# EAGLE design power (EAGLE 7.1.0)
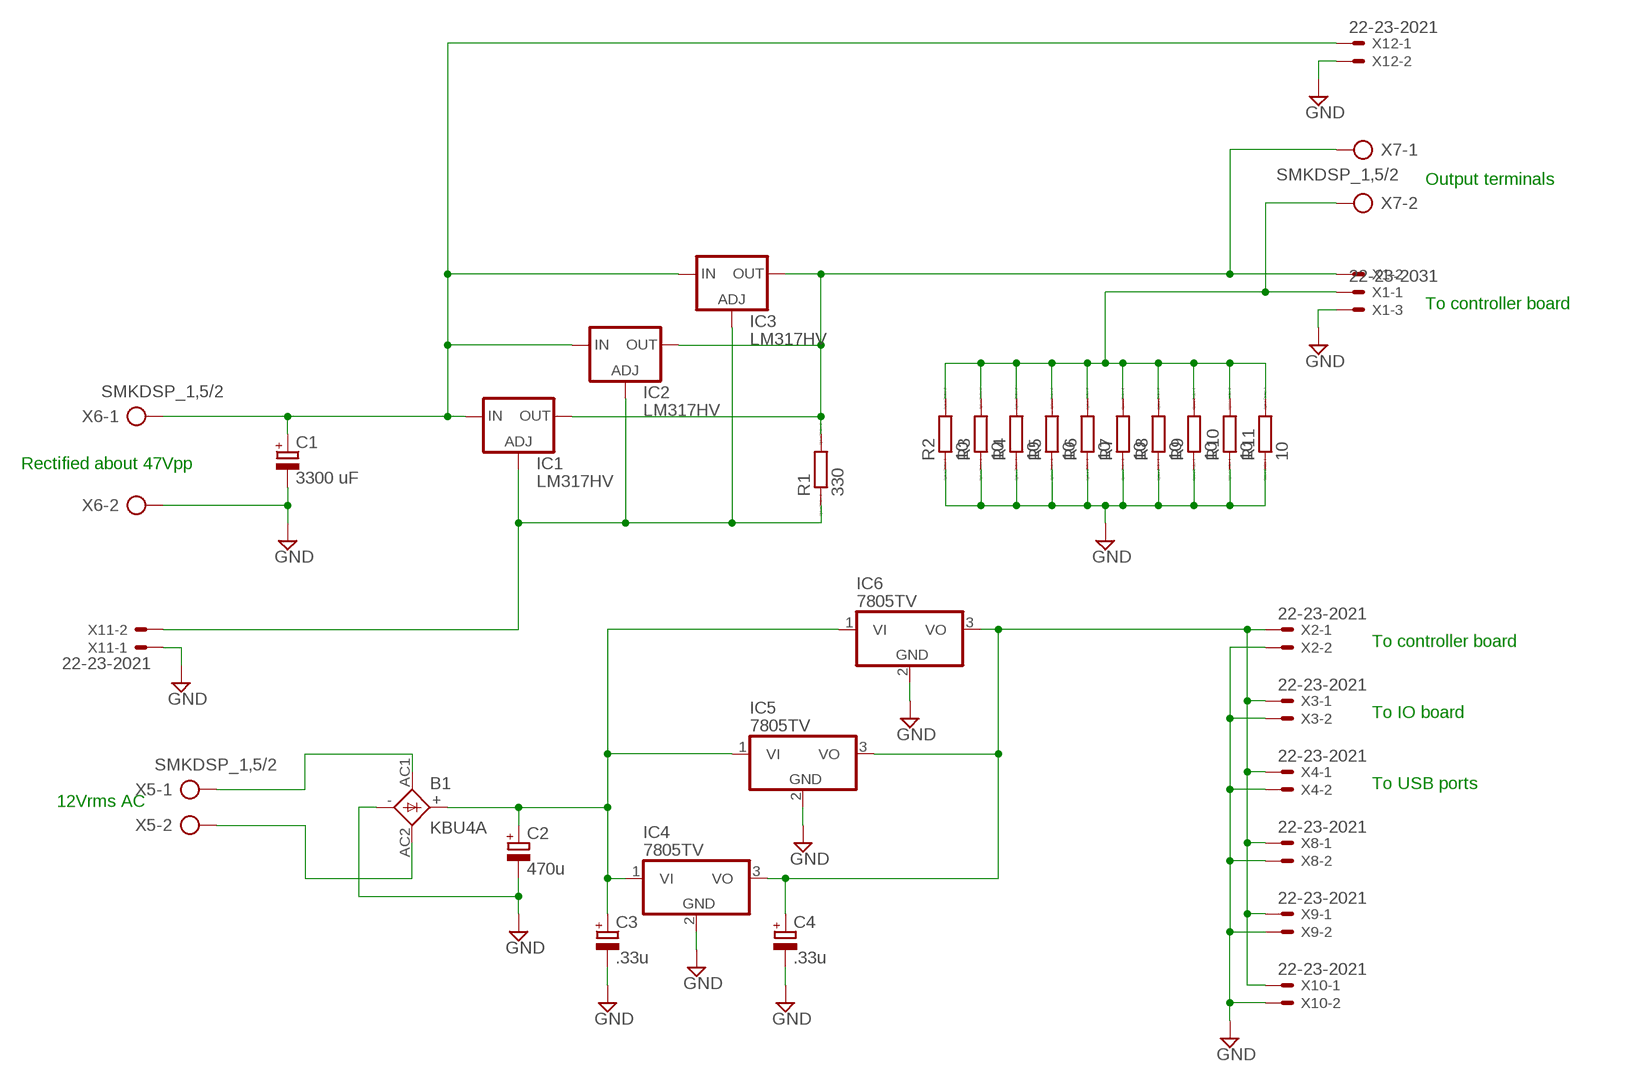
[diagram p0: schematic, sheet 1]

## Parts
B1  KBU4A  2KBB-R  [2KBB-R]
C1  3300 uF  CPOL-EUE10-25  [EB25D]
C2  470u  CPOL-EUE5-10.5  [E5-10,5]
C3  .33u  CPOL-EUE2-5  [E2-5]
C4  .33u  CPOL-EUE2-5  [E2-5]
IC1  LM317HV  LM317TS  [317TS]
IC2  LM317HV  LM317TS  [317TS]
IC3  LM317HV  LM317TS  [317TS]
IC4  7805TV  [TO220V]
IC5  7805TV  [TO220V]
IC6  7805TV  [TO220V]
R1  330  R-EU_0207_7  [0207/7]
R2  10  R-EU_0204_7  [0204/7]
R3  10  R-EU_0204_7  [0204/7]
R4  10  R-EU_0204_7  [0204/7]
R5  10  R-EU_0204_7  [0204/7]
R6  10  R-EU_0204_7  [0204/7]
R7  10  R-EU_0204_7  [0204/7]
R8  10  R-EU_0204_7  [0204/7]
R9  10  R-EU_0204_7  [0204/7]
R10  10  R-EU_0204_7  [0204/7]
R11  10  R-EU_0204_7  [0204/7]
X1  22-23-2031  [22-23-2031]
X2  22-23-2021  [22-23-2021]
X3  22-23-2021  [22-23-2021]
X4  22-23-2021  [22-23-2021]
X5  SMKDSP_1,5/2  [SMKDSP_1,5/2]
X6  SMKDSP_1,5/2  [SMKDSP_1,5/2]
X7  SMKDSP_1,5/2  [SMKDSP_1,5/2]
X8  22-23-2021  [22-23-2021]
X9  22-23-2021  [22-23-2021]
X10  22-23-2021  [22-23-2021]
X11  22-23-2021  [22-23-2021]
X12  22-23-2021  [22-23-2021]

## Nets
GND: B1.- C1.- C2.- C3.- C4.- IC4.2(GND) IC5.2(GND) IC6.2(GND) R2.1 R3.1 R4.1 R5.1 R6.1 R7.1 R8.1 R9.1 R10.1 R11.1 X1.3 X2.2 X3.2 X4.2 X6.2 X8.2 X9.2 X10.2 X11.1 X12.2
N$2: B1.AC1 X5.1
N$3: C1.+ IC1.3(IN) IC2.3(IN) IC3.3(IN) X6.1 X12.1
N$4: B1.AC2 X5.2
N$5: IC1.2(OUT) IC2.2(OUT) IC3.2(OUT) R1.2 X1.2 X7.1
N$7: B1.+ C2.+ C3.+ IC4.1(VI) IC5.1(VI) IC6.1(VI)
N$9: C4.+ IC4.3(VO) IC5.3(VO) IC6.3(VO) X2.1 X3.1 X4.1 X8.1 X9.1 X10.1
N$10: IC1.1(ADJ) IC2.1(ADJ) IC3.1(ADJ) R1.1 X11.2
N$11: R2.2 R3.2 R4.2 R5.2 R6.2 R7.2 R8.2 R9.2 R10.2 R11.2 X1.1 X7.2

## Notes on the sheet
- Output terminals
- To controller board
- Rectified about 47Vpp
- To controller board
- To IO board
- To USB ports
- 12Vrms AC

## Library data of the parts
B1 = rectifier:2KBB-R: RECTIFIER grid 3 x 5 mm
C1-C4 = rcl:CPOL-EU: POLARIZED CAPACITOR, European symbol
IC1-IC3 = v-reg:LM317TS: VOLTAGE REGULATOR
IC4-IC6 = linear:78*: Positive VOLTAGE REGULATOR Source: http://cache.national.com/ds/LM/LM78L05.pdf http://www.fairchildsemi.com/ds/LM/LM7805.pdf
R1-R11 = resistor:R-EU_: RESISTOR, European symbol; SPICEPREFIX: R
X1 = con-molex:22-23-2031: .100" (2.54mm) Center Header - 3 Pin; MF: MOLEX; MPN: 22-23-2031; OC_FARNELL: 1462950; OC_NEWARK: 30C0862
X2-X4 X8-X12 = con-molex:22-23-2021: .100" (2.54mm) Center Header - 2 Pin; MF: MOLEX; MPN: 22-23-2021; OC_FARNELL: 1462926; OC_NEWARK: 25C3832
X5-X7 = con-phoenix-smkdsp:SMKDSP_1,5/2: Printklemme, Nennstrom: 17,5 A, Bemessungsspannung: 250 V, Raster: 5,0 mm Source: http://eshop.phoenixcontact.de .. 1733415.pdf; MF: FARNELL; MPN: 1733570; OC_FARNELL: 3041244; OC_NEWARK: 69C8588

## Board
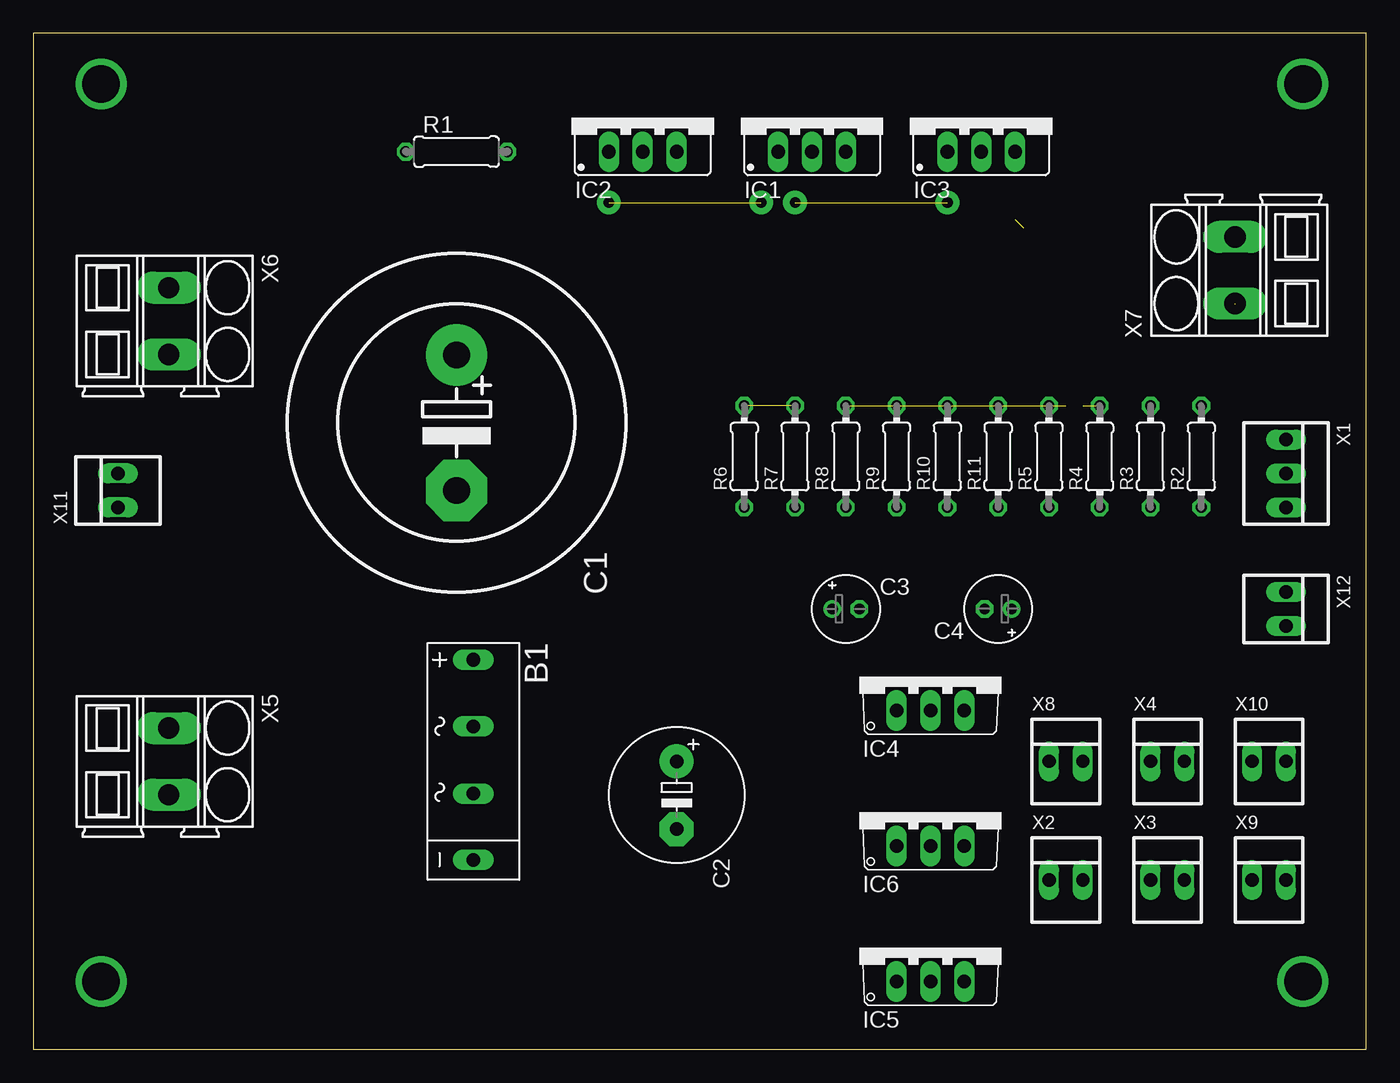
[diagram p1: board, top side]
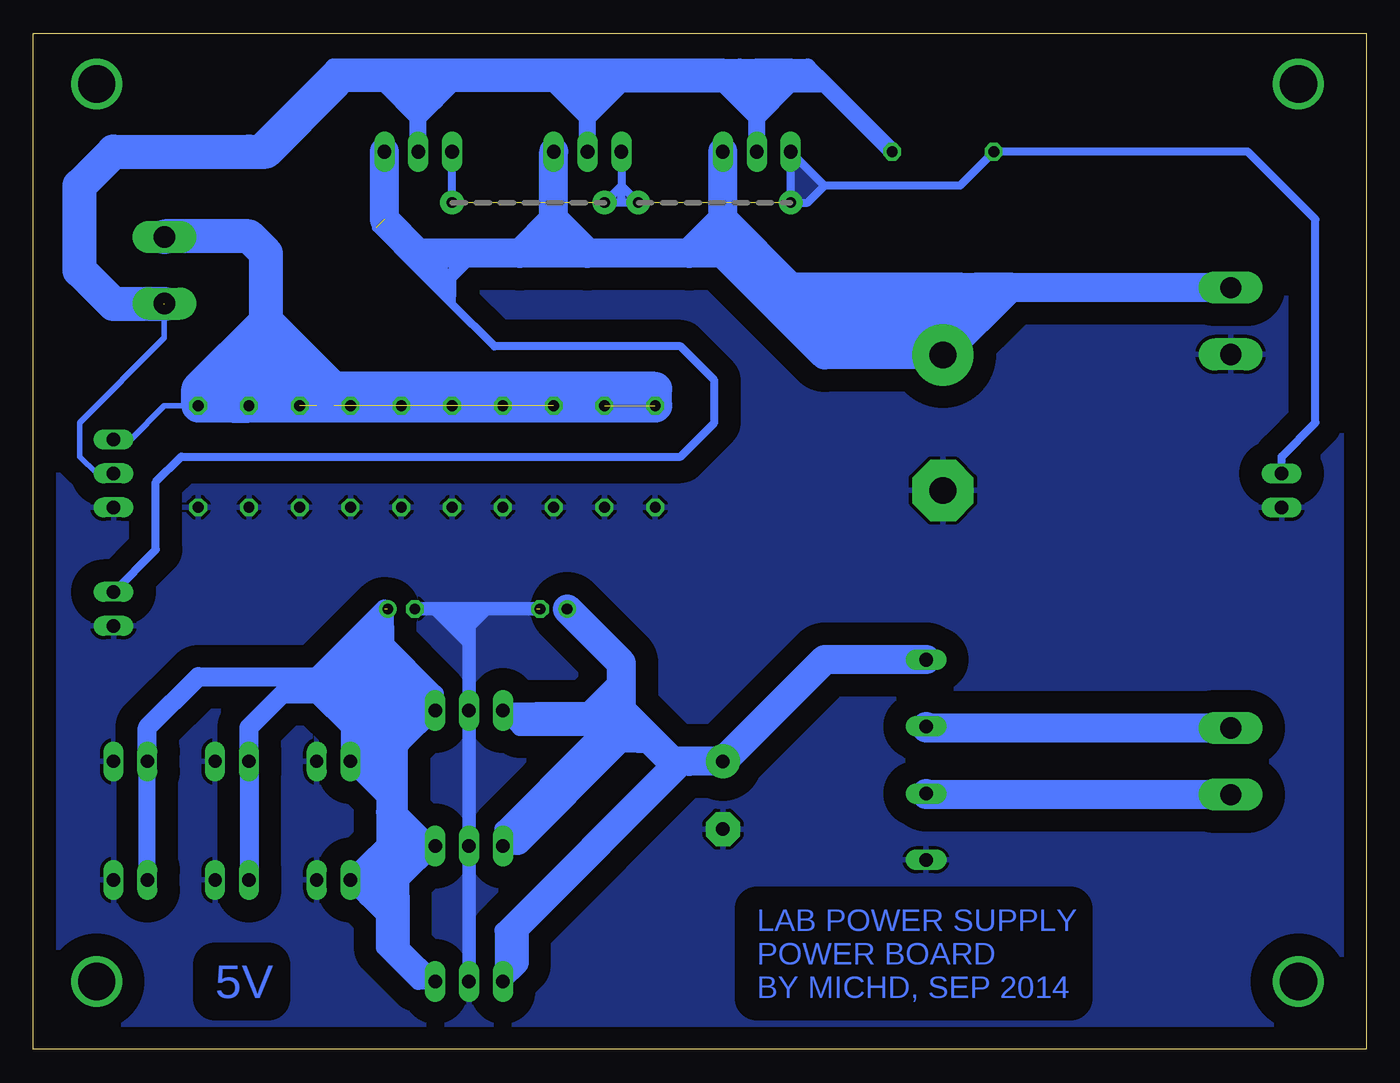
[diagram p2: board, bottom side, seen from below]

Size 100 x 76.19 mm. Coordinates in mm from the lower left corner, seen from the top.
Outline: 0,0 100,0 100,76.19 0,76.19 0,0
Copper layers (1*16): Top 0.035mm / dielectric 1.5mm / Bottom 0.035mm
Design rules "default": minimum track width 10mil, minimum drill 24mil, track to track 8mil, track to pad 8mil, pad to pad 8mil, via to via 8mil, smd to smd 8mil, copper to edge 40mil, drill to drill 8mil, minimum pad ring 10mil, minimum via ring 8mil, stop-mask expansion 4mil, vias tented up to drill 0mil, thermal gap 10mil

### Footprints (pad centres in the part's own frame; a part is rotated, then mirrored left to right if it is on the bottom)
2KBB-R = drill 1.016 long: + -7.62,0; - 7.391,0; AC1 -2.616,0; AC2 2.413,0
EB25D = drill 2.007 pad 4.597: + -5.08,0 | drill 2.007 pad 4.597 octagon: - 5.08,0
E5-10,5 = drill 1.016 pad 2.54: + -2.54,0 | drill 1.016 pad 2.54 octagon: - 2.54,0
E2-5 = drill 0.813 pad 1.27: + -1.016,0 | drill 0.813 pad 1.27 octagon: - 1.016,0
317TS = drill 1.016 long: 1 -2.54,-2.54; 2 0,-2.54; 3 2.54,-2.54
TO220V = drill 1.016 long: 1 -2.54,-2.54; 2 0,-2.54; 3 2.54,-2.54
0207/7 = drill 0.813 octagon: 1 -3.81,0; 2 3.81,0
0204/7 = drill 0.813 octagon: 1 -3.81,0; 2 3.81,0
22-23-2031 = drill 1 long: 1 -2.54,0; 2 0,0; 3 2.54,0
22-23-2021 = drill 1 long: 1 -1.27,0; 2 1.27,0
SMKDSP_1,5/2 = drill 1.6 pad 1.8 long: 1 -2.5,0; 2 2.5,0

### Placement (x,y rotation side)
B1  33.02,21.59 270 top
C1  31.75,46.99 270 top
C2  48.26,19.05 270 top
C3  60.96,33.02 0 top
C4  72.39,33.02 180 top
IC1  58.42,69.85 0 top
IC2  45.72,69.85 0 top
IC3  71.12,69.85 0 top
IC4  67.31,27.94 0 top
IC5  67.31,7.62 0 top
IC6  67.31,17.78 0 top
R1  31.75,67.31 0 top
R2  87.63,44.45 90 top
R3  83.82,44.45 90 top
R4  80.01,44.45 90 top
R5  76.2,44.45 90 top
R6  53.34,44.45 90 top
R7  57.15,44.45 90 top
R8  60.96,44.45 90 top
R9  64.77,44.45 90 top
R10  68.58,44.45 90 top
R11  72.39,44.45 90 top
X1  93.98,43.18 270 top
X2  77.47,12.7 0 top
X3  85.09,12.7 0 top
X4  85.09,21.59 0 top
X5  10.16,21.59 270 top
X6  10.16,54.61 270 top
X7  90.17,58.42 90 top
X8  77.47,21.59 0 top
X9  92.71,12.7 0 top
X10  92.71,21.59 0 top
X11  6.35,41.91 90 top
X12  93.98,33.02 270 top

### Tracks (layer width: path | path; a pad name or v marks a point on that pad's centre or on a via)
GND  (1 unrouted)
  Bottom 0.813: 66.67,32.38 68.58,32.38 68.58,31.75 67.94,31.75
  Bottom 1.016: IC4.2 IC6.2 IC5.2 | 66.04,33.02 69.85,33.02 | 71.12,33.02 69.85,33.02 | 69.85,33.02 68.58,31.75 67.31,30.48 IC4.2 | IC4.2 67.31,31.75 66.67,32.38 66.04,33.02 | 66.04,33.02 62.23,33.02
  pour Bottom (isolate 1.676): 1.27,76.2 99.06,76.2 99.06,1.27 1.27,1.27
N$1  (via drill 2.8 pad 3.81)
  other vias: 5.08,72.39
N$2
  Bottom 2.184: X5.1 33.02,24.09 B1.AC1
N$3  (1 unrouted)
  Bottom 0.61: X12.1 90.81,37.47 90.81,42.55 88.9,44.45 51.44,44.45 48.9,46.99 48.9,50.16 51.44,52.7 65.41,52.7 68.58,55.88 | 68.58,55.88 69.85,57.15 | 70.48,57.78 71.12,58.42 | 71.12,58.42 74.3,61.59 74.3,64.14 | 71.12,58.42 70.48,58.42 69.85,59.05 69.22,59.05 | 69.22,59.05 70.48,57.78 | 70.48,57.78 69.85,57.15 | 69.85,57.15 68.58,58.42 | 68.58,58.42 67.94,59.05 69.22,59.05 | 69.22,59.05 69.22,58.42 69.85,57.78 69.85,57.15 | 68.58,57.78 68.58,56.52 | 68.58,55.88 68.58,56.52 | 68.58,56.52 69.22,57.15 68.58,57.78 | 68.58,57.78 68.58,58.42 | 68.58,57.78 67.31,59.05
  Bottom 2.184: 26.67,57.15 29.21,57.15 | 29.21,57.15 33.02,53.34 40.64,53.34 44.45,57.15 | X6.1 26.71,57.11 C1.+ 40.64,52.07 48.26,59.69 | 48.26,59.69 48.26,60.96 | 48.26,62.23 IC2.3 | 48.26,59.69 50.8,59.69 | 50.8,59.69 58.42,59.69 | 58.42,59.69 63.5,59.69 | 63.5,59.69 71.12,59.69 73.66,62.23 IC3.3 | 58.42,59.69 60.96,62.23 | 60.96,62.23 IC1.3 | 48.26,62.23 50.8,59.69 | 60.96,62.23 63.5,59.69 | 44.45,57.15 48.26,60.96 | 48.26,60.96 48.26,62.23 | 48.26,62.23 43.18,57.15 | 41.91,55.88 40.64,54.61 33.02,54.61 30.48,57.15 | 30.48,57.15 29.21,57.15 | 30.48,57.15 43.18,57.15 | 44.45,57.15 43.18,57.15 | 43.18,57.15 41.91,55.88 | 41.91,55.88 33.02,55.88
N$4
  Bottom 2.184: X5.2 33.02,19.09 B1.AC2
N$5  (1 unrouted)
  Bottom 0.406: X1.2 95.25,43.18 96.52,44.45 96.52,46.99 90.17,53.34 90.17,55.88
  Bottom 1.27: IC3.2 71.12,69.85 | 71.12,69.85 73.66,72.39 | 73.66,72.39 77.47,72.39 76.2,73.66 62.23,73.66 60.96,72.39 | 58.42,69.85 60.96,72.39 | 45.72,68.58 IC2.2 45.72,69.85 | 48.26,73.66 54.61,73.66 | 54.61,73.66 55.88,73.66 | 57.15,73.66 58.42,73.66 | 58.42,73.66 59.69,73.66 | 59.69,73.66 77.47,73.66 83.82,67.31 | 60.96,72.39 68.58,72.39 | 72.39,72.39 73.66,72.39 | 60.96,72.39 59.69,73.66 | 60.96,72.39 59.69,72.39 | 59.69,72.39 58.42,73.66 | 58.42,73.66 58.42,72.39 | 58.42,72.39 58.42,71.12 | IC1.2 58.42,69.85 | 58.42,69.85 58.42,71.12 | 59.69,72.39 58.42,71.12 | 58.42,71.12 55.88,73.66 | 55.88,73.66 57.15,73.66 | 57.15,73.66 58.42,72.39 | 45.72,69.85 45.72,71.12 | 45.72,71.12 46.99,72.39 | 46.99,72.39 48.26,73.66 | 71.12,69.85 69.85,71.12 | 69.85,71.12 68.58,72.39 | 68.58,72.39 71.12,72.39 | 71.12,72.39 71.12,71.12 | 71.12,69.85 71.12,71.12 | 71.12,71.12 72.39,72.39 | 72.39,72.39 71.12,72.39 | 71.12,72.39 69.85,71.12 | 48.26,73.66 46.99,73.66 | 43.18,73.66 41.91,73.66 40.64,72.39 | 40.64,72.39 R1.2 | 45.72,71.12 44.45,72.39 | 44.45,72.39 43.18,73.66 | 43.18,73.66 45.72,73.66 | 45.72,73.66 45.72,72.39 | 45.72,71.12 45.72,72.39 | 45.72,72.39 46.99,73.66 | 46.99,73.66 45.72,73.66 | 45.72,73.66 44.45,72.39 | 58.42,69.85 55.88,72.39 | 54.61,73.66 55.88,72.39 | 55.88,72.39 48.26,72.39 | 48.26,72.39 46.99,72.39 | 46.99,72.39 43.18,72.39 | 43.18,72.39 40.64,72.39 | 48.26,72.39 45.72,69.85 | 45.72,69.85 43.18,72.39
  Bottom 2.54: 90.17,55.88 93.98,55.88 96.52,58.42 96.52,64.77 93.98,67.31 83.82,67.31 82.55,67.31 77.47,72.39
N$6  (via drill 2.8 pad 3.81)
  other vias: 95.25,5.08
N$7
  Bottom 1.016: IC4.1 60.96,25.4 | 57.15,25.4 55.88,25.4
  Bottom 1.27: 55.88,25.4 58.42,22.86 | 57.15,22.86 55.88,24.13 | 55.88,24.13 54.61,22.86 | 54.61,22.86 53.34,22.86 | 54.61,22.86 55.88,22.86 | 57.15,22.86 58.42,22.86 | 58.42,22.86 64.77,16.51 IC6.1 | IC6.1 63.5,15.24 55.88,22.86 | 55.88,22.86 57.15,22.86 | 57.15,22.86 IC6.1 | 63.5,24.13 55.88,24.13 | 55.88,24.13 57.15,25.4 58.42,25.4 | 58.42,25.4 60.96,25.4 62.23,25.4 | 62.23,25.4 63.5,24.13 | 63.5,24.13 IC4.1 62.23,25.4 | 58.42,25.4 55.88,27.94 | 50.8,21.59 63.5,8.89 63.5,6.35 IC5.1 64.77,8.89 52.07,21.59
  Bottom 2.184: B1.+ 40.64,29.21 C2.+ 50.8,21.59 52.07,21.59 53.34,22.86 55.88,25.4 55.88,27.94 55.88,28.96 C3.+
N$8  (via drill 2.8 pad 3.81)
  other vias: 95.25,72.39
N$9  (1 unrouted)
  Bottom 1.016: IC4.3 72.39,27.94 | IC6.3 72.39,17.78 | 72.39,27.94 73.66,29.21 | 73.66,27.94 73.66,26.67 | 73.66,26.67 73.66,25.4 | 73.66,22.86 73.66,21.59 | 73.66,21.59 73.66,20.32 | 73.66,19.05 72.39,17.78 | 72.39,17.78 72.39,19.05 | 72.39,19.05 72.39,20.32 | 72.39,20.32 72.39,21.59 | 72.39,21.59 72.39,22.86 | 72.39,24.13 72.39,25.4 | 72.39,25.4 72.39,26.67 | 72.39,26.67 72.39,27.94 | 72.39,27.94 73.66,27.94 | 73.66,27.94 72.39,26.67 | 72.39,26.67 73.66,26.67 | 73.66,26.67 72.39,25.4 | 72.39,25.4 73.66,25.4 | 73.66,25.4 72.39,24.13 | 72.39,24.13 73.66,24.13 72.39,22.86 | 72.39,22.86 73.66,22.86 | 73.66,22.86 72.39,21.59 | 72.39,21.59 73.66,21.59 | 73.66,21.59 72.39,20.32 | 72.39,20.32 73.66,20.32 | 73.66,20.32 72.39,19.05
  Bottom 1.27: X9.1 X10.1 | 73.66,27.94 73.66,29.21 73.66,30.48 69.85,26.67 IC4.3 | 73.66,19.05 73.66,17.78 | 73.66,8.89 72.39,7.62 | 72.39,7.62 IC5.3 71.12,5.08 73.66,7.62 73.66,8.89 | IC4.3 71.12,25.4 | 71.12,25.4 72.39,26.67 | 71.12,25.4 72.39,25.4 | IC4.3 72.39,22.86 72.39,24.13 71.12,25.4 | IC6.3 72.39,12.7 | 72.39,12.7 73.66,11.43 72.39,11.43 | 73.66,12.7 72.39,13.97 | 72.39,13.97 71.12,15.24 72.39,16.51 | 72.39,16.51 73.66,17.78 | 73.66,17.78 73.66,15.24 72.39,13.97 | 72.39,16.51 72.39,13.97 | 73.66,8.89 73.66,10.16 | 72.39,11.43 72.39,7.62 | 72.39,11.43 72.39,12.7
  Bottom 1.422: 74.93,22.86 X8.1 | X8.1 73.66,19.05 73.66,20.32 | 73.66,20.32 73.66,22.86 | 73.66,22.86 74.93,21.59 73.66,20.32 | X2.1 74.93,13.97 | 74.93,13.97 73.66,15.24 73.66,12.7 | 73.66,12.7 73.66,11.43 73.66,10.16 74.93,11.43 | 74.93,11.43 X2.1 | X2.1 73.66,12.7 | 73.66,12.7 74.93,13.97 | 74.93,13.97 74.93,11.43 | 78.74,26.67 81.28,26.67 83.82,24.13 X4.1 X3.1 | 78.74,26.67 76.2,26.67 | 76.2,26.67 74.93,26.67 | 74.93,26.67 73.66,25.4 | 73.66,25.4 73.66,24.13 | 73.66,24.13 73.66,22.86 | 73.66,25.4 73.66,27.94 74.93,26.67 | X10.1 91.44,24.13 87.63,27.94 78.74,27.94 | 77.47,27.94 76.2,27.94 | 76.2,27.94 74.93,27.94 73.66,29.21 | 76.2,27.94 73.66,30.48 73.66,31.75 | X8.1 76.2,24.13 | 76.2,24.13 76.2,25.4 | 76.2,25.4 76.2,26.67 | 76.2,26.67 73.66,24.13 | 73.66,24.13 74.93,22.86 | 74.93,22.86 74.93,24.13 76.2,25.4 | 76.2,24.13 78.74,26.67 | 78.74,27.94 73.66,33.02 73.66,31.75 | 78.74,27.94 77.47,27.94 | 77.47,27.94 73.66,31.75
N$10  (via drill 0.8 pad 1.78)  (2 unrouted)
  Bottom 0.61: 55.88,63.5 v54.61,63.5 55.88,64.77 | 55.88,63.5 v57.15,63.5 55.88,64.77 | 40.64,64.77 30.48,64.77 R1.1 8.89,67.31 3.81,62.23 3.81,46.99 6.35,44.45 X11.2 | 40.64,64.77 IC2.1 v43.18,63.5 41.91,63.5 40.64,64.77 | IC1.1 55.88,64.77 | 55.88,63.5 55.88,64.77 | v68.58,63.5 IC3.1
  pour Bottom (no thermals): 43.18,67.31 40.64,64.77 41.91,63.5 43.18,63.5
  pour Bottom: 54.61,63.5 55.88,64.77 57.15,63.5
N$11  (7 unrouted)
  Bottom 0.406: X1.1 92.71,45.72 90.17,48.26 R2.2
  Bottom 2.54: 77.47,48.26 R6.2 53.34,49.53 77.47,49.53 | 78.74,48.26 R3.2 | 85.09,48.26 R2.2 | R2.2 86.36,49.53 | 86.36,49.53 82.55,53.34 | 82.55,53.34 82.55,54.61 | 82.55,54.61 82.55,59.69 83.82,60.96 90.13,60.96 X7.2 | 82.55,53.34 77.47,48.26 | 77.47,48.26 78.74,48.26 | 78.74,48.26 82.55,52.07 82.55,50.8 85.09,48.26 | 85.09,48.26 R3.2 | R3.2 82.55,49.53 | 77.47,49.53 86.36,49.53 | 86.36,49.53 87.63,49.53 | R2.2 87.63,49.53 | 87.63,49.53 82.55,54.61 | 82.55,54.61 77.47,49.53
N$12  (via drill 2.8 pad 3.81)
  other vias: 5.08,5.08

### Text on the board
Bottom: LAB POWER SUPPLY / POWER BOARD / BY MICHD, SEP 2014 | 5V